# EAGLE schematic Control Board (EAGLE 9.3.0)
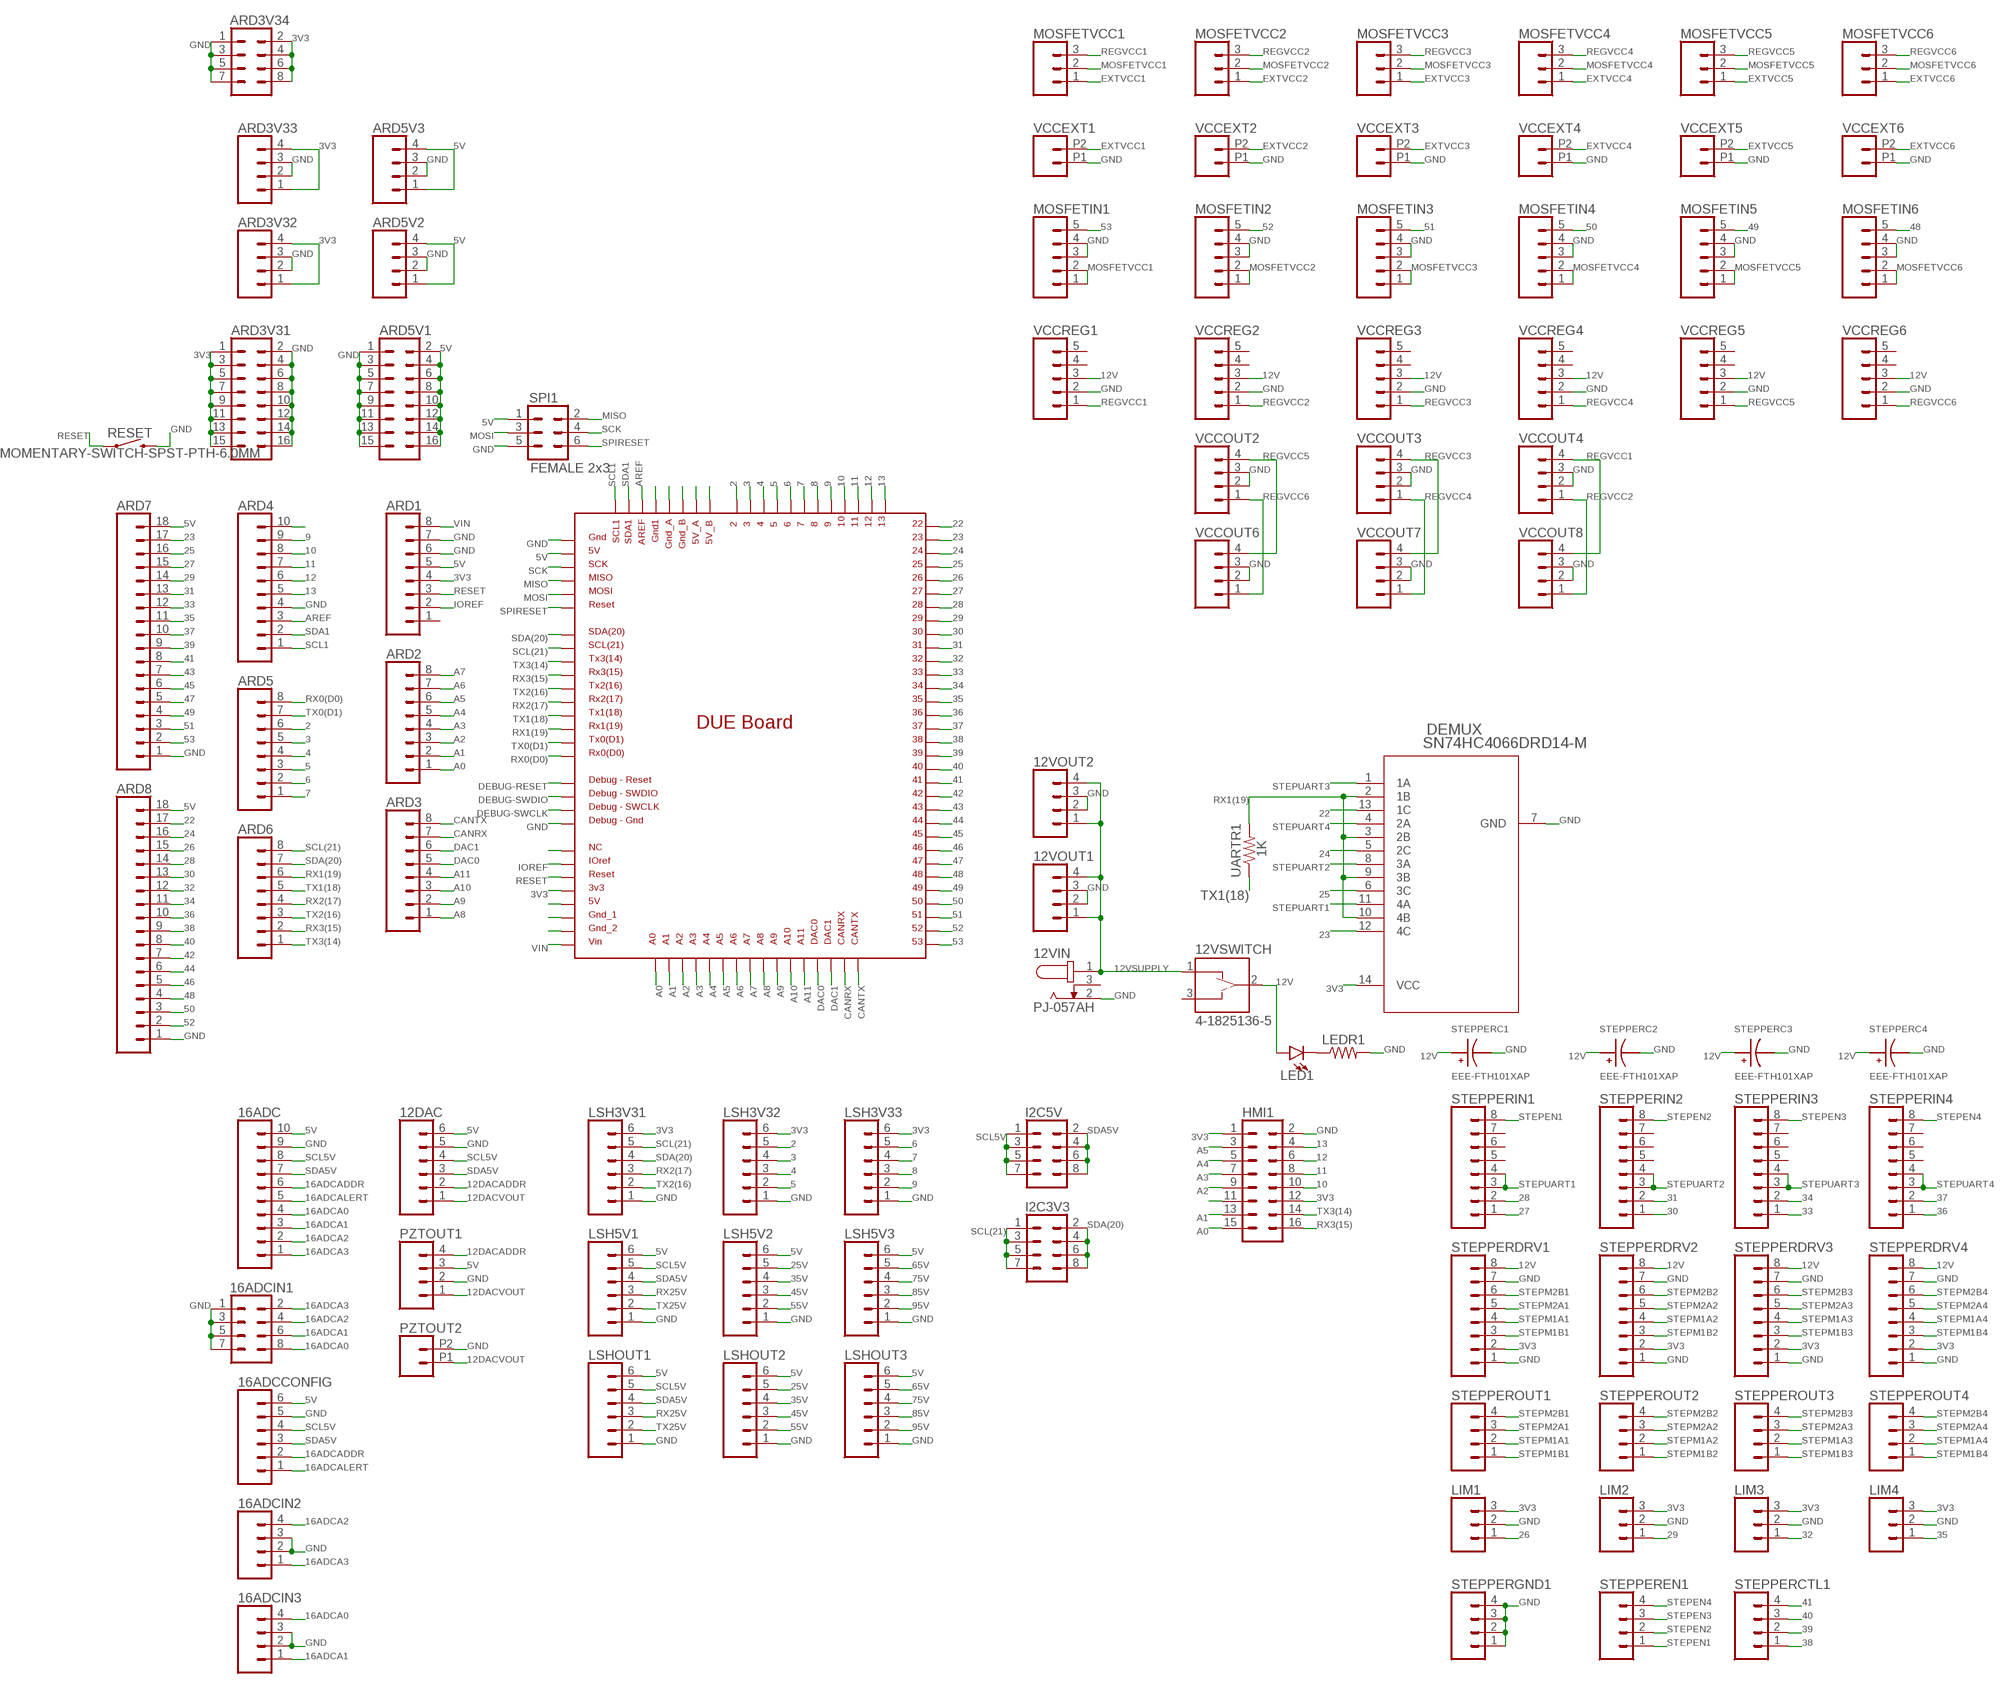
[diagram p0: schematic, sheet 1]

## Parts
12DAC  CONN_06LOCK  [1X06_LOCK]
12VIN  PJ-057AH  [CUI_PJ-057AH]
12VOUT1  CONN_04POLAR  [MOLEX-1X4]
12VOUT2  CONN_04POLAR  [MOLEX-1X4]
12VSWITCH  4-1825136-5  [TE_4-1825136-5]
16ADC  CONN_10LOCK  [1X10_LOCK]
16ADCCONFIG  CONN_06LOCK  [1X06_LOCK]
16ADCIN1  CONN_04X2  [2X4]
16ADCIN2  CONN_04POLAR  [MOLEX-1X4]
16ADCIN3  CONN_04POLAR  [MOLEX-1X4]
ARD1  CONN_08LOCK  [1X08_LOCK]
ARD2  CONN_08LOCK  [1X08_LOCK]
ARD3  CONN_08LOCK  [1X08_LOCK]
ARD3V31  CONN_08X2  [2X8]
ARD3V32  CONN_04POLAR  [MOLEX-1X4]
ARD3V33  CONN_04POLAR  [MOLEX-1X4]
ARD3V34  CONN_04X2  [2X4]
ARD4  CONN_10LOCK  [1X10_LOCK]
ARD5  CONN_08LOCK  [1X08_LOCK]
ARD5V1  CONN_08X2  [2X8]
ARD5V2  CONN_04POLAR  [MOLEX-1X4]
ARD5V3  CONN_04POLAR  [MOLEX-1X4]
ARD6  CONN_08LOCK  [1X08_LOCK]
ARD7  CONN_18  [1X18]
ARD8  CONN_18  [1X18]
DEMUX  SN74HC4066DRD14-M  [D14-M]
HMI1  CONN_08X2  [2X8]
I2C3V3  CONN_04X2  [2X4]
I2C5V  CONN_04X2  [2X4]
LED1  LED3MM  [LED_3MM]
LEDR1  RESISTORAXIAL-0.3  [AXIAL-0.3]
LIM1  CONN_03LOCK  [1X03_LOCK]
LIM2  CONN_03LOCK  [1X03_LOCK]
LIM3  CONN_03LOCK  [1X03_LOCK]
LIM4  CONN_03LOCK  [1X03_LOCK]
LSH3V31  CONN_06NO_SILK_FEMALE_PTH  [1X06_NO_SILK]
LSH3V32  CONN_06NO_SILK_FEMALE_PTH  [1X06_NO_SILK]
LSH3V33  CONN_06NO_SILK_FEMALE_PTH  [1X06_NO_SILK]
LSH5V1  CONN_06NO_SILK_FEMALE_PTH  [1X06_NO_SILK]
LSH5V2  CONN_06NO_SILK_FEMALE_PTH  [1X06_NO_SILK]
LSH5V3  CONN_06NO_SILK_FEMALE_PTH  [1X06_NO_SILK]
LSHOUT1  CONN_06LOCK  [1X06_LOCK]
LSHOUT2  CONN_06LOCK  [1X06_LOCK]
LSHOUT3  CONN_06LOCK  [1X06_LOCK]
MOSFETIN1  CONN_05LOCK  [1X05_LOCK]
MOSFETIN2  CONN_05LOCK  [1X05_LOCK]
MOSFETIN3  CONN_05LOCK  [1X05_LOCK]
MOSFETIN4  CONN_05LOCK  [1X05_LOCK]
MOSFETIN5  CONN_05LOCK  [1X05_LOCK]
MOSFETIN6  CONN_05LOCK  [1X05_LOCK]
MOSFETVCC1  CONN_03LOCK  [1X03_LOCK]
MOSFETVCC2  CONN_03LOCK  [1X03_LOCK]
MOSFETVCC3  CONN_03LOCK  [1X03_LOCK]
MOSFETVCC4  CONN_03LOCK  [1X03_LOCK]
MOSFETVCC5  CONN_03LOCK  [1X03_LOCK]
MOSFETVCC6  CONN_03LOCK  [1X03_LOCK]
PZTOUT1  CONN_04LOCK  [1X04_LOCK]
PZTOUT2  CONN_022.54MM_SCREWTERM  [1X02_2.54_SCREWTERM]
RESET  MOMENTARY-SWITCH-SPST-PTH-6.0MM  [TACTILE_SWITCH_PTH_6.0MM]
SPI1  FEMALE 2x3  CONN_03X2FEMALE  [2X3]
STEPPERC1  EEE-FTH101XAP  [CAPAE660X800N]
STEPPERC2  EEE-FTH101XAP  [CAPAE660X800N]
STEPPERC3  EEE-FTH101XAP  [CAPAE660X800N]
STEPPERC4  EEE-FTH101XAP  [CAPAE660X800N]
STEPPERCTL1  CONN_04LOCK  [1X04_LOCK]
STEPPERDRV1  CONN_08NO_SILK_FEMALE_PTH  [1X08_NO_SILK]
STEPPERDRV2  CONN_08NO_SILK_FEMALE_PTH  [1X08_NO_SILK]
STEPPERDRV3  CONN_08NO_SILK_FEMALE_PTH  [1X08_NO_SILK]
STEPPERDRV4  CONN_08NO_SILK_FEMALE_PTH  [1X08_NO_SILK]
STEPPEREN1  CONN_04LOCK  [1X04_LOCK]
STEPPERGND1  CONN_04LOCK  [1X04_LOCK]
STEPPERIN1  CONN_08NO_SILK_FEMALE_PTH  [1X08_NO_SILK]
STEPPERIN2  CONN_08NO_SILK_FEMALE_PTH  [1X08_NO_SILK]
STEPPERIN3  CONN_08NO_SILK_FEMALE_PTH  [1X08_NO_SILK]
STEPPERIN4  CONN_08NO_SILK_FEMALE_PTH  [1X08_NO_SILK]
STEPPEROUT1  CONN_04POLAR  [MOLEX-1X4]
STEPPEROUT2  CONN_04POLAR  [MOLEX-1X4]
STEPPEROUT3  CONN_04POLAR  [MOLEX-1X4]
STEPPEROUT4  CONN_04POLAR  [MOLEX-1X4]
U$1  DUE-UPSIDEDOWN  [DUE-UPSIDEDOWN]
UARTR1  1K  RESISTOR0805  [0805]
VCCEXT1  CONN_022.54MM_SCREWTERM  [1X02_2.54_SCREWTERM]
VCCEXT2  CONN_022.54MM_SCREWTERM  [1X02_2.54_SCREWTERM]
VCCEXT3  CONN_022.54MM_SCREWTERM  [1X02_2.54_SCREWTERM]
VCCEXT4  CONN_022.54MM_SCREWTERM  [1X02_2.54_SCREWTERM]
VCCEXT5  CONN_022.54MM_SCREWTERM  [1X02_2.54_SCREWTERM]
VCCEXT6  CONN_022.54MM_SCREWTERM  [1X02_2.54_SCREWTERM]
VCCOUT2  CONN_04LOCK  [1X04_LOCK]
VCCOUT3  CONN_04LOCK  [1X04_LOCK]
VCCOUT4  CONN_04LOCK  [1X04_LOCK]
VCCOUT6  CONN_04POLAR  [MOLEX-1X4]
VCCOUT7  CONN_04POLAR  [MOLEX-1X4]
VCCOUT8  CONN_04POLAR  [MOLEX-1X4]
VCCREG1  CONN_05LOCK  [1X05_LOCK]
VCCREG2  CONN_05LOCK  [1X05_LOCK]
VCCREG3  CONN_05LOCK  [1X05_LOCK]
VCCREG4  CONN_05LOCK  [1X05_LOCK]
VCCREG5  CONN_05LOCK  [1X05_LOCK]
VCCREG6  CONN_05LOCK  [1X05_LOCK]

## Nets
2: ARD5.6 LSH3V32.5 U$1.2
3: ARD5.5 LSH3V32.4 U$1.3
3V3: ARD1.4 ARD3V31.1 ARD3V31.3 ARD3V31.5 ARD3V31.7 ARD3V31.9 ARD3V31.11 ARD3V31.13 ARD3V31.15 ARD3V32.1 ARD3V32.4 ARD3V33.1 ARD3V33.4 ARD3V34.2 ARD3V34.4 ARD3V34.6 ARD3V34.8 DEMUX.14(VCC) HMI1.1 HMI1.12 LIM1.3 LIM2.3 LIM3.3 LIM4.3 LSH3V31.6 LSH3V32.6 LSH3V33.6 STEPPERDRV1.2 STEPPERDRV2.2 STEPPERDRV3.2 STEPPERDRV4.2 U$1.3V3
4: ARD5.4 LSH3V32.3 U$1.4
5: ARD5.3 LSH3V32.2 U$1.5
5V: 12DAC.6 16ADC.10 16ADCCONFIG.6 ARD1.5 ARD5V1.2 ARD5V1.4 ARD5V1.6 ARD5V1.8 ARD5V1.10 ARD5V1.12 ARD5V1.14 ARD5V1.16 ARD5V2.1 ARD5V2.4 ARD5V3.1 ARD5V3.4 ARD7.18 ARD8.18 LSH5V1.6 LSH5V2.6 LSH5V3.6 LSHOUT1.6 LSHOUT2.6 LSHOUT3.6 PZTOUT1.3 SPI1.1 U$1.5V U$1.5V_A U$1.5V_B U$1.GND_ICSP
6: ARD5.2 LSH3V33.5 U$1.6
7: ARD5.1 LSH3V33.4 U$1.7
8: ARD4.10 LSH3V33.3 U$1.8
9: ARD4.9 LSH3V33.2 U$1.9
10: ARD4.8 HMI1.10 U$1.10
11: ARD4.7 HMI1.8 U$1.11
12: ARD4.6 HMI1.6 U$1.12
12DACADDR: 12DAC.2 PZTOUT1.4
12DACVOUT: 12DAC.1 PZTOUT1.1 PZTOUT2.P1
12V: 12VSWITCH.2 LED1.A STEPPERC1.1 STEPPERC2.1 STEPPERC3.1 STEPPERC4.1 STEPPERDRV1.8 STEPPERDRV2.8 STEPPERDRV3.8 STEPPERDRV4.8 VCCREG1.3 VCCREG2.3 VCCREG3.3 VCCREG4.3 VCCREG5.3 VCCREG6.3
12VSUPPLY: 12VIN.1 12VOUT1.1 12VOUT1.4 12VOUT2.1 12VOUT2.4 12VSWITCH.1
13: ARD4.5 HMI1.4 U$1.13
16ADCA0: 16ADC.4 16ADCIN1.8 16ADCIN3.4
16ADCA1: 16ADC.3 16ADCIN1.6 16ADCIN3.1
16ADCA2: 16ADC.2 16ADCIN1.4 16ADCIN2.4
16ADCA3: 16ADC.1 16ADCIN1.2 16ADCIN2.1
16ADCADDR: 16ADC.6 16ADCCONFIG.2
16ADCALERT: 16ADC.5 16ADCCONFIG.1
22: ARD8.17 DEMUX.13(1C) U$1.22
23: ARD7.17 DEMUX.12(4C) U$1.23
24: ARD8.16 DEMUX.5(2C) U$1.24
25: ARD7.16 DEMUX.6(3C) U$1.25
25V: LSH5V2.5 LSHOUT2.5
26: ARD8.15 LIM1.1 U$1.26
27: ARD7.15 STEPPERIN1.1 U$1.27
28: ARD8.14 STEPPERIN1.2 U$1.28
29: ARD7.14 LIM2.1 U$1.29
30: ARD8.13 STEPPERIN2.1 U$1.30
31: ARD7.13 STEPPERIN2.2 U$1.31
32: ARD8.12 LIM3.1 U$1.32
33: ARD7.12 STEPPERIN3.1 U$1.33
34: ARD8.11 STEPPERIN3.2 U$1.34
35: ARD7.11 LIM4.1 U$1.35
35V: LSH5V2.4 LSHOUT2.4
36: ARD8.10 STEPPERIN4.1 U$1.36
37: ARD7.10 STEPPERIN4.2 U$1.37
38: ARD8.9 STEPPERCTL1.1 U$1.38
39: ARD7.9 STEPPERCTL1.2 U$1.39
40: ARD8.8 STEPPERCTL1.3 U$1.40
41: ARD7.8 STEPPERCTL1.4 U$1.41
42: ARD8.7 U$1.42
43: ARD7.7 U$1.43
44: ARD8.6 U$1.44
45: ARD7.6 U$1.45
45V: LSH5V2.3 LSHOUT2.3
46: ARD8.5 U$1.46
47: ARD7.5 U$1.47
48: ARD8.4 MOSFETIN6.5 U$1.48
49: ARD7.4 MOSFETIN5.5 U$1.49
50: ARD8.3 MOSFETIN4.5 U$1.50
51: ARD7.3 MOSFETIN3.5 U$1.51
52: ARD8.2 MOSFETIN2.5 U$1.52
53: ARD7.2 MOSFETIN1.5 U$1.53
55V: LSH5V2.2 LSHOUT2.2
65V: LSH5V3.5 LSHOUT3.5
75V: LSH5V3.4 LSHOUT3.4
85V: LSH5V3.3 LSHOUT3.3
95V: LSH5V3.2 LSHOUT3.2
A0: ARD2.1 HMI1.15 U$1.A0
A1: ARD2.2 HMI1.13 U$1.A1
A2: ARD2.3 HMI1.9 U$1.A2
A3: ARD2.4 HMI1.7 U$1.A3
A4: ARD2.5 HMI1.5 U$1.A4
A5: ARD2.6 HMI1.3 U$1.A5
A6: ARD2.7 U$1.A6
A7: ARD2.8 U$1.A7
A8: ARD3.1 U$1.A8
A9: ARD3.2 U$1.A9
A10: ARD3.3 U$1.A10
A11: ARD3.4 U$1.A11
AREF: ARD4.3 U$1.AREF U$1.AREF1(AREF)
CANRX: ARD3.7 U$1.CANRX
CANTX: ARD3.8 U$1.CANTX
DAC0: ARD3.5 U$1.DAC0
DAC1: ARD3.6 U$1.DAC1
DEBUG-RESET: U$1.RESET_DEBUG
DEBUG-SWCLK: U$1.SWCLK_DEBUG
DEBUG-SWDIO: U$1.SWDIO_DEBUG
EXTVCC1: MOSFETVCC1.1 VCCEXT1.P2
EXTVCC2: MOSFETVCC2.1 VCCEXT2.P2
EXTVCC3: MOSFETVCC3.1 VCCEXT3.P2
EXTVCC4: MOSFETVCC4.1 VCCEXT4.P2
EXTVCC5: MOSFETVCC5.1 VCCEXT5.P2
EXTVCC6: MOSFETVCC6.1 VCCEXT6.P2
GND: 12DAC.5 12VIN.2 12VOUT1.2 12VOUT1.3 12VOUT2.2 12VOUT2.3 16ADC.9 16ADCCONFIG.5 16ADCIN1.1 16ADCIN1.3 16ADCIN1.5 16ADCIN1.7 16ADCIN2.2 16ADCIN2.3 16ADCIN3.2 16ADCIN3.3 ARD1.6 ARD1.7 ARD3V31.2 ARD3V31.4 ARD3V31.6 ARD3V31.8 ARD3V31.10 ARD3V31.12 ARD3V31.14 ARD3V31.16 ARD3V32.2 ARD3V32.3 ARD3V33.2 ARD3V33.3 ARD3V34.1 ARD3V34.3 ARD3V34.5 ARD3V34.7 ARD4.4 ARD5V1.1 ARD5V1.3 ARD5V1.5 ARD5V1.7 ARD5V1.9 ARD5V1.11 ARD5V1.13 ARD5V1.15 ARD5V2.2 ARD5V2.3 ARD5V3.2 ARD5V3.3 ARD7.1 ARD8.1 DEMUX.7(GND) HMI1.2 HMI1.11 LEDR1.P$2 LIM1.2 LIM2.2 LIM3.2 LIM4.2 LSH3V31.1 LSH3V32.1 LSH3V33.1 LSH5V1.1 LSH5V2.1 LSH5V3.1 LSHOUT1.1 LSHOUT2.1 LSHOUT3.1 MOSFETIN1.3 MOSFETIN1.4 MOSFETIN2.3 MOSFETIN2.4 MOSFETIN3.3 MOSFETIN3.4 MOSFETIN4.3 MOSFETIN4.4 MOSFETIN5.3 MOSFETIN5.4 MOSFETIN6.3 MOSFETIN6.4 PZTOUT1.2 PZTOUT2.P2 RESET.3 SPI1.5 STEPPERC1.2 STEPPERC2.2 STEPPERC3.2 STEPPERC4.2 STEPPERDRV1.1 STEPPERDRV1.7 STEPPERDRV2.1 STEPPERDRV2.7 STEPPERDRV3.1 STEPPERDRV3.7 STEPPERDRV4.1 STEPPERDRV4.7 STEPPERGND1.1 STEPPERGND1.2 STEPPERGND1.3 STEPPERGND1.4 U$1.5V_ICSP U$1.GND1 U$1.GND_1 U$1.GND_2 U$1.GND_A U$1.GND_B U$1.GND_DEBUG VCCEXT1.P1 VCCEXT2.P1 VCCEXT3.P1 VCCEXT4.P1 VCCEXT5.P1 VCCEXT6.P1 VCCOUT2.2 VCCOUT2.3 VCCOUT3.2 VCCOUT3.3 VCCOUT4.2 VCCOUT4.3 VCCOUT6.2 VCCOUT6.3 VCCOUT7.2 VCCOUT7.3 VCCOUT8.2 VCCOUT8.3 VCCREG1.2 VCCREG2.2 VCCREG3.2 VCCREG4.2 VCCREG5.2 VCCREG6.2
IOREF: ARD1.2 U$1.IOREF
MISO: SPI1.2 U$1.MISO_ICSP
MOSFETVCC1: MOSFETIN1.1 MOSFETIN1.2 MOSFETVCC1.2
MOSFETVCC2: MOSFETIN2.1 MOSFETIN2.2 MOSFETVCC2.2
MOSFETVCC3: MOSFETIN3.1 MOSFETIN3.2 MOSFETVCC3.2
MOSFETVCC4: MOSFETIN4.1 MOSFETIN4.2 MOSFETVCC4.2
MOSFETVCC5: MOSFETIN5.1 MOSFETIN5.2 MOSFETVCC5.2
MOSFETVCC6: MOSFETIN6.1 MOSFETIN6.2 MOSFETVCC6.2
MOSI: SPI1.3 U$1.MOSI_ICSP
N$1: LED1.K(C) LEDR1.P$1
N$21: U$1.NC
REGVCC1: MOSFETVCC1.3 VCCOUT4.4 VCCOUT8.4 VCCREG1.1
REGVCC2: MOSFETVCC2.3 VCCOUT4.1 VCCOUT8.1 VCCREG2.1
REGVCC3: MOSFETVCC3.3 VCCOUT3.4 VCCOUT7.4 VCCREG3.1
REGVCC4: MOSFETVCC4.3 VCCOUT3.1 VCCOUT7.1 VCCREG4.1
REGVCC5: MOSFETVCC5.3 VCCOUT2.4 VCCOUT6.4 VCCREG5.1
REGVCC6: MOSFETVCC6.3 VCCOUT2.1 VCCOUT6.1 VCCREG6.1
RESET: ARD1.3 RESET.1 U$1.RESET
RX0(D0): ARD5.8 U$1.RX0
RX1(19): ARD6.6 DEMUX.2(1B) DEMUX.3(2B) DEMUX.9(3B) DEMUX.10(4B) U$1.RX1 UARTR1.2
RX2(17): ARD6.4 LSH3V31.3 U$1.RX2
RX3(15): ARD6.2 HMI1.16 U$1.RX3
RX25V: LSH5V1.3 LSHOUT1.3
SCK: SPI1.4 U$1.SCK_ICSP
SCL1: ARD4.1 U$1.SCL1
SCL5V: 12DAC.4 16ADC.8 16ADCCONFIG.4 I2C5V.1 I2C5V.3 I2C5V.5 I2C5V.7 LSH5V1.5 LSHOUT1.5
SCL(21): ARD6.8 I2C3V3.1 I2C3V3.3 I2C3V3.5 I2C3V3.7 LSH3V31.5 U$1.SCL
SDA1: ARD4.2 U$1.SDA1
SDA5V: 12DAC.3 16ADC.7 16ADCCONFIG.3 I2C5V.2 I2C5V.4 I2C5V.6 I2C5V.8 LSH5V1.4 LSHOUT1.4
SDA(20): ARD6.7 I2C3V3.2 I2C3V3.4 I2C3V3.6 I2C3V3.8 LSH3V31.4 U$1.SDA
SPIRESET: SPI1.6 U$1.RESET_ICSP
STEPEN1: STEPPEREN1.1 STEPPERIN1.8
STEPEN2: STEPPEREN1.2 STEPPERIN2.8
STEPEN3: STEPPEREN1.3 STEPPERIN3.8
STEPEN4: STEPPEREN1.4 STEPPERIN4.8
STEPM1A1: STEPPERDRV1.4 STEPPEROUT1.2
STEPM1A2: STEPPERDRV2.4 STEPPEROUT2.2
STEPM1A3: STEPPERDRV3.4 STEPPEROUT3.2
STEPM1A4: STEPPERDRV4.4 STEPPEROUT4.2
STEPM1B1: STEPPERDRV1.3 STEPPEROUT1.1
STEPM1B2: STEPPERDRV2.3 STEPPEROUT2.1
STEPM1B3: STEPPERDRV3.3 STEPPEROUT3.1
STEPM1B4: STEPPERDRV4.3 STEPPEROUT4.1
STEPM2A1: STEPPERDRV1.5 STEPPEROUT1.3
STEPM2A2: STEPPERDRV2.5 STEPPEROUT2.3
STEPM2A3: STEPPERDRV3.5 STEPPEROUT3.3
STEPM2A4: STEPPERDRV4.5 STEPPEROUT4.3
STEPM2B1: STEPPERDRV1.6 STEPPEROUT1.4
STEPM2B2: STEPPERDRV2.6 STEPPEROUT2.4
STEPM2B3: STEPPERDRV3.6 STEPPEROUT3.4
STEPM2B4: STEPPERDRV4.6 STEPPEROUT4.4
STEPUART1: DEMUX.11(4A) STEPPERIN1.3 STEPPERIN1.4
STEPUART2: DEMUX.8(3A) STEPPERIN2.3 STEPPERIN2.4
STEPUART3: DEMUX.1(1A) STEPPERIN3.3 STEPPERIN3.4
STEPUART4: DEMUX.4(2A) STEPPERIN4.3 STEPPERIN4.4
TX0(D1): ARD5.7 U$1.TX0
TX1(18): ARD6.5 U$1.TX1 UARTR1.1
TX2(16): ARD6.3 LSH3V31.2 U$1.TX2
TX3(14): ARD6.1 HMI1.14 U$1.TX3
TX25V: LSH5V1.2 LSHOUT1.2
VIN: ARD1.8 U$1.VIN
Unconnected: 12VIN.3 12VSWITCH.3 ARD1.1 STEPPERIN1.5 STEPPERIN1.6 STEPPERIN1.7 STEPPERIN2.5 STEPPERIN2.6 STEPPERIN2.7 STEPPERIN3.5 STEPPERIN3.6 STEPPERIN3.7 STEPPERIN4.5 STEPPERIN4.6 STEPPERIN4.7 VCCREG1.4 VCCREG1.5 VCCREG2.4 VCCREG2.5 VCCREG3.4 VCCREG3.5 VCCREG4.4 VCCREG4.5 VCCREG5.4 VCCREG5.5 VCCREG6.4 VCCREG6.5

## Library data of the parts
12DAC 16ADCCONFIG LSHOUT1-LSHOUT3 = SparkFun-Connectors:CONN_06: Multi connection point. Often used as Generic Header-pin footprint for 0.1 inch spaced/style header connections On any of the 0.1 inch spaced packages, you can populate with these: Break Away Headers - Straight <https://www.sparkfun.com/products/116> (PRT-00116) Break Away Male Headers - Right Angle <https://www.sparkfun.com/products/553> (PRT-00553) Female Headers <https://www.sparkfun.com/products/115> (PRT-00115) Break Away Headers - Machine Pin <https://www.sparkfun.com/products/117> (PRT-00117) Break Away Female Headers - Swiss Machine Pin <https://www.sparkfun.com/products/743> (PRT-00743) Arduino Stackable Header - 6 Pin <https://www.sparkfun.com/products/9280> (PRT-09280) For SCREWTERMINALS and SPRING TERMINALS visit here: Screw Terimnals on SparkFun.com <https://www.sparkfun.com/search/results?term=Screw+Terminals> (5mm/3.5mm/2.54mm spacing) This device is also useful as a general connection point to wire up your design to another part of your project. Our various solder wires solder well into these plated through hole pads. Hook-Up Wire - Assortment (Stranded, 22 AWG) <https://www.sparkfun.com/products/11375> (PRT-11375) Hook-Up Wire - Assortment (Solid Core, 22 AWG) <https://www.sparkfun.com/products/11367> (PRT-11367) View the entire wire category on our website here <https://www.sparkfun.com/categories/141>
12VIN = PJ-057AH:PJ-057AH: 2.0 mm Center Pin, 5.0 A, Right Angle, Through Hole, Pick-n-Place Top, Dc Power Jack Connector; CUI_PURCHASE_URL: https://www.cui.com/product/interconnect/connectors/dc-power-connectors/jacks/pj-057ah?utm_source=snapeda.com&utm_medium=referral&utm_campaign=snapedaBOM; DESCRIPTION: 2.0 x 6.3 mm, 5.0 A, Horizontal, Through Hole, Pick-n-Place Top, Dc Power Jack Connector; DIGI-KEY_PART_NUMBER: CP-057AH-ND; DIGI-KEY_PURCHASE_URL: https://www.digikey.com/product-detail/en/cui-inc/PJ-057AH/CP-057AH-ND/1644601?utm_source=snapeda&utm_medium=aggregator&utm_campaign=symbol; MF: CUI Inc.; MP: PJ-057AH; PACKAGE: None
12VOUT1 12VOUT2 16ADCIN2 16ADCIN3 ARD3V32 ARD3V33 ARD5V2 ARD5V3 STEPPEROUT1-STEPPEROUT4 VCCOUT6-VCCOUT8 = SparkFun-Connectors:CONN_04: Multi connection point. Often used as Generic Header-pin footprint for 0.1 inch spaced/style header connections On any of the 0.1 inch spaced packages, you can populate with these: Break Away Headers - Straight <https://www.sparkfun.com/products/116> (PRT-00116) Break Away Male Headers - Right Angle <https://www.sparkfun.com/products/553> (PRT-00553) Female Headers <https://www.sparkfun.com/products/115> (PRT-00115) Break Away Headers - Machine Pin <https://www.sparkfun.com/products/117> (PRT-00117) Break Away Female Headers - Swiss Machine Pin <https://www.sparkfun.com/products/743> (PRT-00743) For SCREWTERMINALS and SPRING TERMINALS visit here: Screw Terimnals on SparkFun.com <https://www.sparkfun.com/search/results?term=Screw+Terminals> (5mm/3.5mm/2.54mm spacing) This device is also useful as a general connection point to wire up your design to another part of your project. Our various solder wires solder well into these plated through hole pads. Hook-Up Wire - Assortment (Stranded, 22 AWG) <https://www.sparkfun.com/products/11375> (PRT-11375) Hook-Up Wire - Assortment (Solid Core, 22 AWG) <https://www.sparkfun.com/products/11367> (PRT-11367) View the entire wire category on our website here <https://www.sparkfun.com/categories/141> Special notes: Molex polarized connector foot print use with SKU : PRT-08231 with associated crimp pins and housings. 1MM SMD Version SKU: PRT-10208; PROD_ID: CONN-08186; SF_ID: PRT-08231
12VSWITCH = 4-1825136-5:4-1825136-5: Switch Toggle ON None ON SPDT Long Baton Lever PC Pins 5A 250VAC 28VDC PC Mount with Threads Bulk; COMMENT: 4-1825136-5; DESCRIPTION: Switch Toggle ON None ON SPDT Long Baton Lever PC Pins 5A 250VAC 28VDC PC Mount with Threads Bulk; DIGI-KEY_PART_NUMBER: 450-1784-ND; DIGI-KEY_PURCHASE_URL: https://www.digikey.com/product-detail/en/te-connectivity-alcoswitch-switches/4-1825136-5/450-1784-ND/3283587?utm_source=snapeda&utm_medium=aggregator&utm_campaign=symbol; EU_ROHS_COMPLIANCE: Compliant with Exemptions; MF: TE Connectivity; MP: 4-1825136-5; PACKAGE: SOIC-8 TE Connectivity; TE_PURCHASE_URL: https://www.te.com/usa-en/product-4-1825136-5.html?te_bu=Cor&te_type=disp&te_campaign=seda_glo_cor-seda-global-disp-prtnr-fy19-seda-model-bom-cta_sma-317_1&elqCampaignId=32493
16ADC ARD4 = SparkFun-Connectors:CONN_10: Multi connection point. Often used as Generic Header-pin footprint for 0.1 inch spaced/style header connections On any of the 0.1 inch spaced packages, you can populate with these: Break Away Headers - Straight <https://www.sparkfun.com/products/116> (PRT-00116) Break Away Male Headers - Right Angle <https://www.sparkfun.com/products/553> (PRT-00553) Female Headers <https://www.sparkfun.com/products/115> (PRT-00115) Break Away Headers - Machine Pin <https://www.sparkfun.com/products/117> (PRT-00117) Break Away Female Headers - Swiss Machine Pin <https://www.sparkfun.com/products/743> (PRT-00743) Arduino Stackable Header - 10 Pin <https://www.sparkfun.com/products/11376> (PRT-11376) For SCREWTERMINALS and SPRING TERMINALS visit here: Screw Terimnals on SparkFun.com <https://www.sparkfun.com/search/results?term=Screw+Terminals> (5mm/3.5mm/2.54mm spacing) This device is also useful as a general connection point to wire up your design to another part of your project. Our various solder wires solder well into these plated through hole pads. Hook-Up Wire - Assortment (Stranded, 22 AWG) <https://www.sparkfun.com/products/11375> (PRT-11375) Hook-Up Wire - Assortment (Solid Core, 22 AWG) <https://www.sparkfun.com/products/11367> (PRT-11367) View the entire wire category on our website here <https://www.sparkfun.com/categories/141> Special notes: Molex polarized connector foot print use with SKU : PRT-08231 with associated crimp pins and housings. 1MM SMD Version SKU: PRT-10208 NOTES ON THE VARIANTS LOCK and LOCK_LONGPADS... This footprint was designed to help hold the alignment of a through-hole component (i.e. 6-pin header) while soldering it into place. You may notice that each hole has been shifted either up or down by 0.005 of an inch from it's more standard position (which is a perfectly straight line). This slight alteration caused the pins (the squares in the middle) to touch the edges of the holes. Because they are alternating, it causes a "brace" to hold the component in place. 0.005 has proven to be the perfect amount of "off-center" position when using our standard breakaway headers. Although looks a little odd when you look at the bare footprint, once you have a header in there, the alteration is very hard to notice. Also,if you push a header all the way into place, it is covered up entirely on the bottom side.
16ADCIN1 ARD3V34 I2C3V3 I2C5V = SparkFun-Connectors:CONN_04X2: Multi connection point. Often used as Generic Header-pin footprint for 0.1 inch spaced/style header connections On any of the 0.1 inch spaced packages, you can populate with these: Break Away Headers - Straight <https://www.sparkfun.com/products/116> (PRT-00116) Break Away Male Headers - Right Angle <https://www.sparkfun.com/products/553> (PRT-00553) Female Headers <https://www.sparkfun.com/products/115> (PRT-00115) Break Away Headers - Machine Pin <https://www.sparkfun.com/products/117> (PRT-00117) Break Away Female Headers - Swiss Machine Pin <https://www.sparkfun.com/products/743> (PRT-00743)
ARD1-ARD3 ARD5 ARD6 = SparkFun-Connectors:CONN_08: Multi connection point. Often used as Generic Header-pin footprint for 0.1 inch spaced/style header connections On any of the 0.1 inch spaced packages, you can populate with these: Break Away Headers - Straight <https://www.sparkfun.com/products/116> (PRT-00116) Break Away Male Headers - Right Angle <https://www.sparkfun.com/products/553> (PRT-00553) Female Headers <https://www.sparkfun.com/products/115> (PRT-00115) Break Away Headers - Machine Pin <https://www.sparkfun.com/products/117> (PRT-00117) Break Away Female Headers - Swiss Machine Pin <https://www.sparkfun.com/products/743> (PRT-00743) Arduino Stackable Header - 8 Pin <https://www.sparkfun.com/products/9279> (PRT-09279) For SCREWTERMINALS and SPRING TERMINALS visit here: Screw Terimnals on SparkFun.com <https://www.sparkfun.com/search/results?term=Screw+Terminals> (5mm/3.5mm/2.54mm spacing) This device is also useful as a general connection point to wire up your design to another part of your project. Our various solder wires solder well into these plated through hole pads. Hook-Up Wire - Assortment (Stranded, 22 AWG) <https://www.sparkfun.com/products/11375> (PRT-11375) Hook-Up Wire - Assortment (Solid Core, 22 AWG) <https://www.sparkfun.com/products/11367> (PRT-11367) View the entire wire category on our website here <https://www.sparkfun.com/categories/141> Special notes: Molex polarized connector foot print use with SKU : PRT-08231 with associated crimp pins and housings. 1MM SMD Version SKU: PRT-10208 NOTES ON THE VARIANTS LOCK and LOCK_LONGPADS... This footprint was designed to help hold the alignment of a through-hole component (i.e. 6-pin header) while soldering it into place. You may notice that each hole has been shifted either up or down by 0.005 of an inch from it's more standard position (which is a perfectly straight line). This slight alteration caused the pins (the squares in the middle) to touch the edges of the holes. Because they are alternating, it causes a "brace" to hold the component in place. 0.005 has proven to be the perfect amount of "off-center" position when using our standard breakaway headers. Although looks a little odd when you look at the bare footprint, once you have a header in there, the alteration is very hard to notice. Also,if you push a header all the way into place, it is covered up entirely on the bottom side.
ARD3V31 ARD5V1 HMI1 = SparkFun-Connectors:CONN_08X2: Multi connection point. Often used as Generic Header-pin footprint for 0.1 inch spaced/style header connections You can populate with any combo of single row headers, but if you'd like an exact match, check this: Header - 2x8 (Male, 0.1") <https://www.sparkfun.com/products/13156> (PRT-13156) On any of the 0.1 inch spaced packages, you can populate with these: Break Away Headers - Straight <https://www.sparkfun.com/products/116> (PRT-00116) Break Away Male Headers - Right Angle <https://www.sparkfun.com/products/553> (PRT-00553) Female Headers <https://www.sparkfun.com/products/115> (PRT-00115) Break Away Headers - Machine Pin <https://www.sparkfun.com/products/117> (PRT-00117) Break Away Female Headers - Swiss Machine Pin <https://www.sparkfun.com/products/743> (PRT-00743)
ARD7 ARD8 = SparkFun-Connectors:CONN_18: Multi connection point. Often used as Generic Header-pin footprint for 0.1 inch spaced/style header connections On any of the 0.1 inch spaced packages, you can populate with these: Break Away Headers - Straight <https://www.sparkfun.com/products/116> (PRT-00116) Break Away Male Headers - Right Angle <https://www.sparkfun.com/products/553> (PRT-00553) Female Headers <https://www.sparkfun.com/products/115> (PRT-00115) Break Away Headers - Machine Pin <https://www.sparkfun.com/products/117> (PRT-00117) Break Away Female Headers - Swiss Machine Pin <https://www.sparkfun.com/products/743> (PRT-00743) For SCREWTERMINALS and SPRING TERMINALS visit here: Screw Terimnals on SparkFun.com <https://www.sparkfun.com/search/results?term=Screw+Terminals> (5mm/3.5mm/2.54mm spacing) This device is also useful as a general connection point to wire up your design to another part of your project. Our various solder wires solder well into these plated through hole pads. Hook-Up Wire - Assortment (Stranded, 22 AWG) <https://www.sparkfun.com/products/11375> (PRT-11375) Hook-Up Wire - Assortment (Solid Core, 22 AWG) <https://www.sparkfun.com/products/11367> (PRT-11367) View the entire wire category on our website here <https://www.sparkfun.com/categories/141> Special notes: Molex polarized connector foot print use with SKU : PRT-08231 with associated crimp pins and housings. 1MM SMD Version SKU: PRT-10208 NOTES ON THE VARIANTS LOCK and LOCK_LONGPADS... This footprint was designed to help hold the alignment of a through-hole component (i.e. 6-pin header) while soldering it into place. You may notice that each hole has been shifted either up or down by 0.005 of an inch from it's more standard position (which is a perfectly straight line). This slight alteration caused the pins (the squares in the middle) to touch the edges of the holes. Because they are alternating, it causes a "brace" to hold the component in place. 0.005 has proven to be the perfect amount of "off-center" position when using our standard breakaway headers. Although looks a little odd when you look at the bare footprint, once you have a header in there, the alteration is very hard to notice. Also,if you push a header all the way into place, it is covered up entirely on the bottom side.
DEMUX = Digikey Imports:SN74HC4066DR; MANUFACTURER_PART_NUMBER: SN74HC4066DR; VENDOR: Texas Instruments
LED1 = SparkFun-LED:LED: LED (Generic) Standard schematic elements and footprints for 5mm, 3mm, 1206, and 0603 sized LEDs. Generic LEDs with no color specified.; PROD_ID: DIO-08794
LEDR1 UARTR1 = SparkFun-Resistors:RESISTOR: Generic Resistor Package
LIM1-LIM4 MOSFETVCC1-MOSFETVCC6 = SparkFun-Connectors:CONN_03: Multi connection point. Often used as Generic Header-pin footprint for 0.1 inch spaced/style header connections On any of the 0.1 inch spaced packages, you can populate with these: Break Away Headers - Straight <https://www.sparkfun.com/products/116> (PRT-00116) Break Away Male Headers - Right Angle <https://www.sparkfun.com/products/553> (PRT-00553) Female Headers <https://www.sparkfun.com/products/115> (PRT-00115) Break Away Headers - Machine Pin <https://www.sparkfun.com/products/117> (PRT-00117) Break Away Female Headers - Swiss Machine Pin <https://www.sparkfun.com/products/743> (PRT-00743) Stackable Header - 3 Pin (Female, 0.1") <https://www.sparkfun.com/products/13875> (PRT-13875) For SCREWTERMINALS and SPRING TERMINALS visit here: Screw Terimnals on SparkFun.com <https://www.sparkfun.com/search/results?term=Screw+Terminals> (5mm/3.5mm/2.54mm spacing) This device is also useful as a general connection point to wire up your design to another part of your project. Our various solder wires solder well into these plated through hole pads. Hook-Up Wire - Assortment (Stranded, 22 AWG) <https://www.sparkfun.com/products/11375> (PRT-11375) Hook-Up Wire - Assortment (Solid Core, 22 AWG) <https://www.sparkfun.com/products/11367> (PRT-11367) View the entire wire category on our website here <https://www.sparkfun.com/categories/141> Special notes: Molex polarized connector foot print use with SKU : PRT-08232 with associated crimp pins and housings.
LSH3V31-LSH3V33 LSH5V1-LSH5V3 = SparkFun-Connectors:CONN_06: Multi connection point. Often used as Generic Header-pin footprint for 0.1 inch spaced/style header connections On any of the 0.1 inch spaced packages, you can populate with these: Break Away Headers - Straight <https://www.sparkfun.com/products/116> (PRT-00116) Break Away Male Headers - Right Angle <https://www.sparkfun.com/products/553> (PRT-00553) Female Headers <https://www.sparkfun.com/products/115> (PRT-00115) Break Away Headers - Machine Pin <https://www.sparkfun.com/products/117> (PRT-00117) Break Away Female Headers - Swiss Machine Pin <https://www.sparkfun.com/products/743> (PRT-00743) Arduino Stackable Header - 6 Pin <https://www.sparkfun.com/products/9280> (PRT-09280) For SCREWTERMINALS and SPRING TERMINALS visit here: Screw Terimnals on SparkFun.com <https://www.sparkfun.com/search/results?term=Screw+Terminals> (5mm/3.5mm/2.54mm spacing) This device is also useful as a general connection point to wire up your design to another part of your project. Our various solder wires solder well into these plated through hole pads. Hook-Up Wire - Assortment (Stranded, 22 AWG) <https://www.sparkfun.com/products/11375> (PRT-11375) Hook-Up Wire - Assortment (Solid Core, 22 AWG) <https://www.sparkfun.com/products/11367> (PRT-11367) View the entire wire category on our website here <https://www.sparkfun.com/categories/141>; PROD_ID: CONN-08437
MOSFETIN1-MOSFETIN6 VCCREG1-VCCREG6 = SparkFun-Connectors:CONN_05: Multi connection point. Often used as Generic Header-pin footprint for 0.1 inch spaced/style header connections On any of the 0.1 inch spaced packages, you can populate with these: Break Away Headers - Straight <https://www.sparkfun.com/products/116> (PRT-00116) Break Away Male Headers - Right Angle <https://www.sparkfun.com/products/553> (PRT-00553) Female Headers <https://www.sparkfun.com/products/115> (PRT-00115) Break Away Headers - Machine Pin <https://www.sparkfun.com/products/117> (PRT-00117) Break Away Female Headers - Swiss Machine Pin <https://www.sparkfun.com/products/743> (PRT-00743) For SCREWTERMINALS and SPRING TERMINALS visit here: Screw Terimnals on SparkFun.com <https://www.sparkfun.com/search/results?term=Screw+Terminals> (5mm/3.5mm/2.54mm spacing) This device is also useful as a general connection point to wire up your design to another part of your project. Our various solder wires solder well into these plated through hole pads. Hook-Up Wire - Assortment (Stranded, 22 AWG) <https://www.sparkfun.com/products/11375> (PRT-11375) Hook-Up Wire - Assortment (Solid Core, 22 AWG) <https://www.sparkfun.com/products/11367> (PRT-11367) View the entire wire category on our website here <https://www.sparkfun.com/categories/141> Special notes: Molex polarized connector foot print use with SKU : PRT-08231 with associated crimp pins and housings. 1MM SMD Version SKU: PRT-10208
PZTOUT1 STEPPERCTL1 STEPPEREN1 STEPPERGND1 VCCOUT2-VCCOUT4 = SparkFun-Connectors:CONN_04: Multi connection point. Often used as Generic Header-pin footprint for 0.1 inch spaced/style header connections On any of the 0.1 inch spaced packages, you can populate with these: Break Away Headers - Straight <https://www.sparkfun.com/products/116> (PRT-00116) Break Away Male Headers - Right Angle <https://www.sparkfun.com/products/553> (PRT-00553) Female Headers <https://www.sparkfun.com/products/115> (PRT-00115) Break Away Headers - Machine Pin <https://www.sparkfun.com/products/117> (PRT-00117) Break Away Female Headers - Swiss Machine Pin <https://www.sparkfun.com/products/743> (PRT-00743) For SCREWTERMINALS and SPRING TERMINALS visit here: Screw Terimnals on SparkFun.com <https://www.sparkfun.com/search/results?term=Screw+Terminals> (5mm/3.5mm/2.54mm spacing) This device is also useful as a general connection point to wire up your design to another part of your project. Our various solder wires solder well into these plated through hole pads. Hook-Up Wire - Assortment (Stranded, 22 AWG) <https://www.sparkfun.com/products/11375> (PRT-11375) Hook-Up Wire - Assortment (Solid Core, 22 AWG) <https://www.sparkfun.com/products/11367> (PRT-11367) View the entire wire category on our website here <https://www.sparkfun.com/categories/141> Special notes: Molex polarized connector foot print use with SKU : PRT-08231 with associated crimp pins and housings. 1MM SMD Version SKU: PRT-10208; PROD_ID: CONN-09696
PZTOUT2 VCCEXT1-VCCEXT6 = SparkFun-Connectors:CONN_02: Multi connection point. Often used as Generic Header-pin footprint for 0.1 inch spaced/style header connections On any of the 0.1 inch spaced packages, you can populate with these: Break Away Headers - Straight <https://www.sparkfun.com/products/116> (PRT-00116) Break Away Male Headers - Right Angle <https://www.sparkfun.com/products/553> (PRT-00553) Female Headers <https://www.sparkfun.com/products/115> (PRT-00115) Break Away Headers - Machine Pin <https://www.sparkfun.com/products/117> (PRT-00117) Break Away Female Headers - Swiss Machine Pin <https://www.sparkfun.com/products/743> (PRT-00743) For SCREWTERMINALS and SPRING TERMINALS visit here: Screw Terimnals on SparkFun.com <https://www.sparkfun.com/search/results?term=Screw+Terminals> (5mm/3.5mm/2.54mm spacing) This device is also useful as a general connection point to wire up your design to another part of your project. Our various solder wires solder well into these plated through hole pads. Hook-Up Wire - Assortment (Stranded, 22 AWG) <https://www.sparkfun.com/products/11375> (PRT-11375) Hook-Up Wire - Assortment (Solid Core, 22 AWG) <https://www.sparkfun.com/products/11367> (PRT-11367) View the entire wire category on our website here <https://www.sparkfun.com/categories/141> Special notes: Molex polarized connector foot print use with: PRT-08233 with associated crimp pins and housings. 2.54_SCREWTERM for use with PRT-10571. 3.5mm Screw Terminal footprints for PRT-08084 5mm Screw Terminal footprints for use with PRT-08432
RESET = SparkFun-Switches:MOMENTARY-SWITCH-SPST: Momentary Switch (Pushbutton) - SPST Normally-open (NO) SPST momentary switches (buttons, pushbuttons). Variants PTH-12MM - 12mm square, through-hole Momentary Pushbutton Switch - 12mm Square <https://www.sparkfun.com/products/9190> (COM-09190) PTH-6.0MM, PTH-6.0MM-KIT - 6.0mm square, through-hole Mini Pushbutton Switch <https://www.sparkfun.com/products/97> (COM-00097) KIT package intended for soldering kit's - only one side of pads' copper is exposed. PTH-RIGHT-ANGLE-KIT - Right-angle, through-hole Right Angle Tactile Button <https://www.sparkfun.com/products/10791> - Used on SparkFun BigTime Watch Kit <https://www.sparkfun.com/products/11734> SMD-12MM - 12mm square, surface-mount Tactile Button - SMD (12mm) <https://www.sparkfun.com/products/12993> (COM-12993) Used on SparkFun PicoBoard <https://www.sparkfun.com/products/11888> SMD-4.5MM - 4.5mm Square Trackball Switch Used on SparkFun Blackberry Trackballer Breakout <https://www.sparkfun.com/products/13169> SMD-4.6MMX2.8MM - 4.60mm x 2.80mm, surface mount Used on SparkFun SAMD21 Mini Breakout <https://www.sparkfun.com/products/13664> SMD-5.2MM, SMD-5.2-REDUNDANT - 5.2mm square, surface-mount Mini Pushbutton Switch - SMD <https://www.sparkfun.com/products/8720> (COM-08720) Used on Arduino Pro Mini <https://www.sparkfun.com/products/11114> REDUNDANT package connects both switch circuits together SMD-6.0X3.5MM - 6.0 x 3.5mm, surface mount Momentary Reset Switch SMD <https://www.sparkfun.com/products/8229> (COM-08229) SMD-6.2MM-TALL - 6.2mm square, surface mount Tactile Button - SMD (6mm) <https://www.sparkfun.com/products/12992> Used on SparkFun Digital Sandbox <https://www.sparkfun.com/products/12651> SMD-RIGHT-ANGLE - Right-angle, surface mount Used on SparkFun Block for Intel® Edison - Arduino <https://www.sparkfun.com/products/13036>; PROD_ID: SWCH-08441; SF_SKU: COM-00097
SPI1 = SparkFun-Connectors:CONN_03X2: Multi connection point. Often used as Generic Header-pin footprint for 0.1 inch spaced/style header connections You can populate with any combo of single row headers, but if you'd like an exact match, check these: Header - 2x3 (Male, 0.1") <https://www.sparkfun.com/products/12807> (PRT-12807) Header - 2x3 (Female, 0.1") <https://www.sparkfun.com/products/13010> (PRT-13010) 2x3 Pin Shrouded Header <https://www.sparkfun.com/products/10877> (PRT-10877) On any of the 0.1 inch spaced packages, you can populate with these: Break Away Headers - Straight <https://www.sparkfun.com/products/116> (PRT-00116) Break Away Male Headers - Right Angle <https://www.sparkfun.com/products/553> (PRT-00553) Female Headers <https://www.sparkfun.com/products/115> (PRT-00115) Break Away Headers - Machine Pin <https://www.sparkfun.com/products/117> (PRT-00117) Break Away Female Headers - Swiss Machine Pin <https://www.sparkfun.com/products/743> (PRT-00743) Special note: the shrouded connector mates well with our 3x2 ribbon cables: Ribbon Crimp Connector - 6-pin (2x3, Female) <https://www.sparkfun.com/products/10651> (PRT-10651) Ribbon Cable - 6 wire (15ft) <https://www.sparkfun.com/products/10646> (PRT-10646); PROD_ID: CONN-11566
STEPPERC1-STEPPERC4 = EEE-FTH101XAP:EEE-FTH101XAP: Cap Aluminum Lytic 100uF 50V 20% (6.3 X 7.7mm) SMD 0.34 Ohm 350mA 2000h 105Â°C Automotive T/R; DESCRIPTION: Cap Aluminum Lytic 100uF 50V 20% _6.3 X 7.7mm_ SMD 0.34 Ohm 350mA 2000h 105°C Automotive T/R; DIGI-KEY_PART_NUMBER: PCE5024CT-ND; DIGI-KEY_PURCHASE_URL: https://www.digikey.com/product-detail/en/panasonic-electronic-components/EEE-FTH101XAP/PCE5024CT-ND/2652079?utm_source=snapeda&utm_medium=aggregator&utm_campaign=symbol; MF: Panasonic Electronic; MP: EEE-FTH101XAP; PACKAGE: Radial Panasonic Electronic
STEPPERDRV1-STEPPERDRV4 STEPPERIN1-STEPPERIN4 = SparkFun-Connectors:CONN_08: Multi connection point. Often used as Generic Header-pin footprint for 0.1 inch spaced/style header connections On any of the 0.1 inch spaced packages, you can populate with these: Break Away Headers - Straight <https://www.sparkfun.com/products/116> (PRT-00116) Break Away Male Headers - Right Angle <https://www.sparkfun.com/products/553> (PRT-00553) Female Headers <https://www.sparkfun.com/products/115> (PRT-00115) Break Away Headers - Machine Pin <https://www.sparkfun.com/products/117> (PRT-00117) Break Away Female Headers - Swiss Machine Pin <https://www.sparkfun.com/products/743> (PRT-00743) Arduino Stackable Header - 8 Pin <https://www.sparkfun.com/products/9279> (PRT-09279) For SCREWTERMINALS and SPRING TERMINALS visit here: Screw Terimnals on SparkFun.com <https://www.sparkfun.com/search/results?term=Screw+Terminals> (5mm/3.5mm/2.54mm spacing) This device is also useful as a general connection point to wire up your design to another part of your project. Our various solder wires solder well into these plated through hole pads. Hook-Up Wire - Assortment (Stranded, 22 AWG) <https://www.sparkfun.com/products/11375> (PRT-11375) Hook-Up Wire - Assortment (Solid Core, 22 AWG) <https://www.sparkfun.com/products/11367> (PRT-11367) View the entire wire category on our website here <https://www.sparkfun.com/categories/141> Special notes: Molex polarized connector foot print use with SKU : PRT-08231 with associated crimp pins and housings. 1MM SMD Version SKU: PRT-10208 NOTES ON THE VARIANTS LOCK and LOCK_LONGPADS... This footprint was designed to help hold the alignment of a through-hole component (i.e. 6-pin header) while soldering it into place. You may notice that each hole has been shifted either up or down by 0.005 of an inch from it's more standard position (which is a perfectly straight line). This slight alteration caused the pins (the squares in the middle) to touch the edges of the holes. Because they are alternating, it causes a "brace" to hold the component in place. 0.005 has proven to be the perfect amount of "off-center" position when using our standard breakaway headers. Although looks a little odd when you look at the bare footprint, once you have a header in there, the alteration is very hard to notice. Also,if you push a header all the way into place, it is covered up entirely on the bottom side.; PROD_ID: CONN-08438
U$1 = DUElib130425:DUE-UPSIDEDOWN: Due board for mounting upside-down on top of a larger board